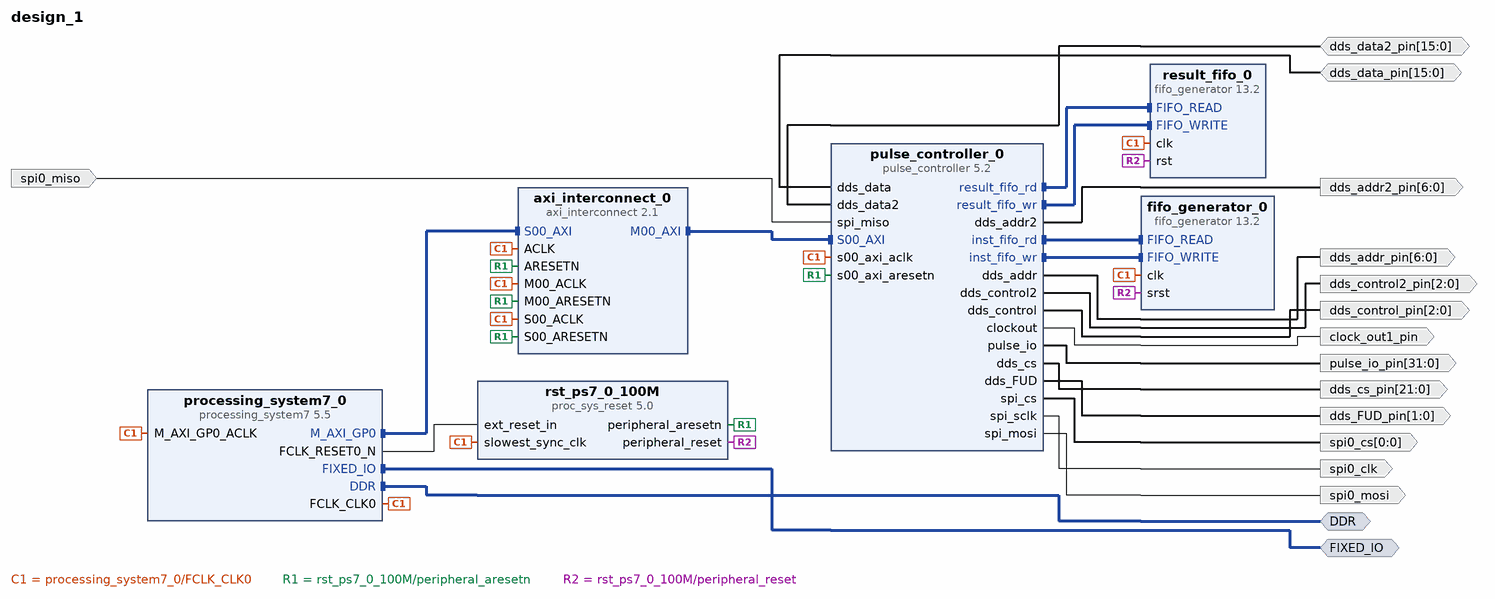
[diagram p0: block diagram of the top level]
# Vivado block design design_1, xc7z020clg484-1, Vivado 2020.1
create_bd_design design_1

create_bd_intf_port -mode Master -vlnv xilinx.com:interface:ddrx_rtl:1.0 DDR
create_bd_intf_port -mode Master -vlnv xilinx.com:display_processing_system7:fixedio_rtl:1.0 FIXED_IO
create_bd_port -dir O clock_out1_pin
create_bd_port -dir O -from 6 -to 0 dds_addr2_pin
create_bd_port -dir O -from 6 -to 0 dds_addr_pin
create_bd_port -dir O -from 2 -to 0 dds_control2_pin
create_bd_port -dir O -from 2 -to 0 dds_control_pin
create_bd_port -dir O -from 21 -to 0 dds_cs_pin
create_bd_port -dir IO -from 15 -to 0 dds_data2_pin
create_bd_port -dir IO -from 15 -to 0 dds_data_pin
create_bd_port -dir O -from 1 -to 0 dds_FUD_pin
create_bd_port -dir O -from 31 -to 0 pulse_io_pin
create_bd_port -dir O spi0_clk
create_bd_port -dir O -from 0 -to 0 spi0_cs
create_bd_port -dir I spi0_miso
create_bd_port -dir O spi0_mosi

create_bd_cell -type ip -vlnv xilinx.com:ip:processing_system7:5.5 processing_system7_0
set_property -dict [list \
  CONFIG.PCW_APU_PERIPHERAL_FREQMHZ 666.666666 \
  CONFIG.PCW_CAN0_CAN0_IO {MIO 46 .. 47} \
  CONFIG.PCW_CAN0_PERIPHERAL_ENABLE 1 \
  CONFIG.PCW_CAN_PERIPHERAL_FREQMHZ 23.8095 \
  CONFIG.PCW_ENET0_ENET0_IO {MIO 16 .. 27} \
  CONFIG.PCW_ENET0_GRP_MDIO_ENABLE 1 \
  CONFIG.PCW_ENET0_GRP_MDIO_IO {MIO 52 .. 53} \
  CONFIG.PCW_ENET0_PERIPHERAL_ENABLE 1 \
  CONFIG.PCW_ENET0_PERIPHERAL_FREQMHZ {100 Mbps} \
  CONFIG.PCW_ENET0_RESET_ENABLE 1 \
  CONFIG.PCW_ENET0_RESET_IO {MIO 11} \
  CONFIG.PCW_ENET_RESET_ENABLE 1 \
  CONFIG.PCW_ENET_RESET_SELECT {Share reset pin} \
  CONFIG.PCW_FPGA0_PERIPHERAL_FREQMHZ 100 \
  CONFIG.PCW_GPIO_MIO_GPIO_ENABLE 1 \
  CONFIG.PCW_GPIO_MIO_GPIO_IO MIO \
  CONFIG.PCW_I2C0_GRP_INT_ENABLE 0 \
  CONFIG.PCW_I2C0_I2C0_IO {MIO 50 .. 51} \
  CONFIG.PCW_I2C0_PERIPHERAL_ENABLE 1 \
  CONFIG.PCW_I2C0_RESET_ENABLE 1 \
  CONFIG.PCW_I2C0_RESET_IO {MIO 13} \
  CONFIG.PCW_I2C_PERIPHERAL_FREQMHZ 111.111115 \
  CONFIG.PCW_I2C_RESET_ENABLE 1 \
  CONFIG.PCW_I2C_RESET_SELECT {Share reset pin} \
  CONFIG.PCW_PRESET_BANK0_VOLTAGE {LVCMOS 1.8V} \
  CONFIG.PCW_PRESET_BANK1_VOLTAGE {LVCMOS 1.8V} \
  CONFIG.PCW_QSPI_GRP_FBCLK_ENABLE 1 \
  CONFIG.PCW_QSPI_GRP_FBCLK_IO {MIO 8} \
  CONFIG.PCW_QSPI_GRP_SINGLE_SS_ENABLE 1 \
  CONFIG.PCW_QSPI_GRP_SINGLE_SS_IO {MIO 1 .. 6} \
  CONFIG.PCW_QSPI_PERIPHERAL_ENABLE 1 \
  CONFIG.PCW_QSPI_QSPI_IO {MIO 1 .. 6} \
  CONFIG.PCW_SD0_GRP_CD_ENABLE 1 \
  CONFIG.PCW_SD0_GRP_CD_IO {MIO 0} \
  CONFIG.PCW_SD0_GRP_WP_ENABLE 1 \
  CONFIG.PCW_SD0_GRP_WP_IO {MIO 15} \
  CONFIG.PCW_SD0_PERIPHERAL_ENABLE 1 \
  CONFIG.PCW_SD0_SD0_IO {MIO 40 .. 45} \
  CONFIG.PCW_SDIO_PERIPHERAL_FREQMHZ 50 \
  CONFIG.PCW_SINGLE_QSPI_DATA_MODE x4 \
  CONFIG.PCW_TTC0_PERIPHERAL_ENABLE 1 \
  CONFIG.PCW_TTC0_TTC0_IO EMIO \
  CONFIG.PCW_UART1_PERIPHERAL_ENABLE 1 \
  CONFIG.PCW_UART1_UART1_IO {MIO 48 .. 49} \
  CONFIG.PCW_UART_PERIPHERAL_FREQMHZ 50 \
  CONFIG.PCW_UIPARAM_DDR_FREQ_MHZ 533.333333 \
  CONFIG.PCW_UIPARAM_DDR_PARTNO {MT41J256M8 HX-15E} \
  CONFIG.PCW_USB0_PERIPHERAL_ENABLE 1 \
  CONFIG.PCW_USB0_RESET_ENABLE 1 \
  CONFIG.PCW_USB0_RESET_IO {MIO 7} \
  CONFIG.PCW_USB0_USB0_IO {MIO 28 .. 39} \
  CONFIG.PCW_USB_RESET_ENABLE 1 \
  CONFIG.PCW_USB_RESET_SELECT {Share reset pin} \
  CONFIG.preset ZC702 \
] [get_bd_cells processing_system7_0]
# 222 more settings of processing_system7_0 are not shown: defaults, MIO pin electricals, DDR timing, and values the tool derives
create_bd_cell -type ip -vlnv xilinx.com:ip:proc_sys_reset:5.0 rst_ps7_0_100M
create_bd_cell -type ip -vlnv xilinx.com:ip:fifo_generator:13.2 fifo_generator_0
set_property -dict [list \
  CONFIG.Fifo_Implementation Common_Clock_Block_RAM \
  CONFIG.Input_Data_Width 32 \
  CONFIG.Input_Depth 8192 \
  CONFIG.Output_Data_Width 64 \
  CONFIG.Overflow_Flag false \
  CONFIG.Performance_Options First_Word_Fall_Through \
  CONFIG.Reset_Type Synchronous_Reset \
  CONFIG.Use_Dout_Reset true \
  CONFIG.Use_Embedded_Registers false \
  CONFIG.Valid_Flag false \
] [get_bd_cells fifo_generator_0]
create_bd_cell -type ip -vlnv xilinx.com:ip:axi_interconnect:2.1 axi_interconnect_0
set_property -dict {CONFIG.NUM_MI 1} [get_bd_cells axi_interconnect_0]
create_bd_cell -type ip -vlnv xilinx.com:ip:fifo_generator:13.2 result_fifo_0
set_property -dict [list \
  CONFIG.Fifo_Implementation Common_Clock_Builtin_FIFO \
  CONFIG.Input_Data_Width 32 \
  CONFIG.Input_Depth 4096 \
  CONFIG.Performance_Options First_Word_Fall_Through \
] [get_bd_cells result_fifo_0]
create_bd_cell -type ip -vlnv nigrp.org:nigrp:pulse_controller:5.2 pulse_controller_0

# ---- connections ----

connect_bd_intf_net [get_bd_intf_pins axi_interconnect_0/M00_AXI] [get_bd_intf_pins pulse_controller_0/S00_AXI]
connect_bd_intf_net [get_bd_intf_pins pulse_controller_0/inst_fifo_rd] [get_bd_intf_pins fifo_generator_0/FIFO_READ]
connect_bd_intf_net [get_bd_intf_ports FIXED_IO] [get_bd_intf_pins processing_system7_0/FIXED_IO]
connect_bd_intf_net [get_bd_intf_ports DDR] [get_bd_intf_pins processing_system7_0/DDR]
connect_bd_intf_net [get_bd_intf_pins processing_system7_0/M_AXI_GP0] [get_bd_intf_pins axi_interconnect_0/S00_AXI]
connect_bd_intf_net [get_bd_intf_pins pulse_controller_0/result_fifo_rd] [get_bd_intf_pins result_fifo_0/FIFO_READ]
connect_bd_intf_net [get_bd_intf_pins pulse_controller_0/result_fifo_wr] [get_bd_intf_pins result_fifo_0/FIFO_WRITE]
connect_bd_intf_net [get_bd_intf_pins pulse_controller_0/inst_fifo_wr] [get_bd_intf_pins fifo_generator_0/FIFO_WRITE]
connect_bd_net [get_bd_pins processing_system7_0/FCLK_CLK0] \
  [get_bd_pins rst_ps7_0_100M/slowest_sync_clk] [get_bd_pins processing_system7_0/M_AXI_GP0_ACLK] \
  [get_bd_pins fifo_generator_0/clk] [get_bd_pins axi_interconnect_0/ACLK] [get_bd_pins axi_interconnect_0/S00_ACLK] \
  [get_bd_pins axi_interconnect_0/M00_ACLK] [get_bd_pins result_fifo_0/clk] [get_bd_pins pulse_controller_0/s00_axi_aclk]
connect_bd_net [get_bd_pins processing_system7_0/FCLK_RESET0_N] [get_bd_pins rst_ps7_0_100M/ext_reset_in]
connect_bd_net [get_bd_ports spi0_miso] [get_bd_pins pulse_controller_0/spi_miso]
connect_bd_net [get_bd_pins pulse_controller_0/pulse_io] [get_bd_ports pulse_io_pin]
connect_bd_net [get_bd_pins pulse_controller_0/dds_addr] [get_bd_ports dds_addr_pin]
connect_bd_net [get_bd_pins pulse_controller_0/dds_addr2] [get_bd_ports dds_addr2_pin]
connect_bd_net [get_bd_ports dds_data_pin] [get_bd_pins pulse_controller_0/dds_data]
connect_bd_net [get_bd_ports dds_data2_pin] [get_bd_pins pulse_controller_0/dds_data2]
connect_bd_net [get_bd_pins pulse_controller_0/dds_control] [get_bd_ports dds_control_pin]
connect_bd_net [get_bd_pins pulse_controller_0/dds_control2] [get_bd_ports dds_control2_pin]
connect_bd_net [get_bd_pins pulse_controller_0/dds_FUD] [get_bd_ports dds_FUD_pin]
connect_bd_net [get_bd_pins pulse_controller_0/dds_cs] [get_bd_ports dds_cs_pin]
connect_bd_net [get_bd_pins pulse_controller_0/spi_cs] [get_bd_ports spi0_cs]
connect_bd_net [get_bd_pins pulse_controller_0/spi_mosi] [get_bd_ports spi0_mosi]
connect_bd_net -net pulse_controller_0_spi_clk [get_bd_pins pulse_controller_0/spi_sclk] [get_bd_ports spi0_clk]
connect_bd_net -net pulse_controller_0_clock_out [get_bd_pins pulse_controller_0/clockout] [get_bd_ports clock_out1_pin]
connect_bd_net [get_bd_pins rst_ps7_0_100M/peripheral_aresetn] \
  [get_bd_pins axi_interconnect_0/ARESETN] [get_bd_pins axi_interconnect_0/S00_ARESETN] \
  [get_bd_pins axi_interconnect_0/M00_ARESETN] [get_bd_pins pulse_controller_0/s00_axi_aresetn]
connect_bd_net [get_bd_pins rst_ps7_0_100M/peripheral_reset] [get_bd_pins fifo_generator_0/srst] [get_bd_pins result_fifo_0/rst]

# ---- address map ----
assign_bd_address -offset 0x73000000 -range 64K -target_address_space [get_bd_addr_spaces processing_system7_0/Data] [get_bd_addr_segs pulse_controller_0/S00_AXI/S00_AXI_reg]

validate_bd_design
save_bd_design
